# Altium project EnergyController.PrjPcb
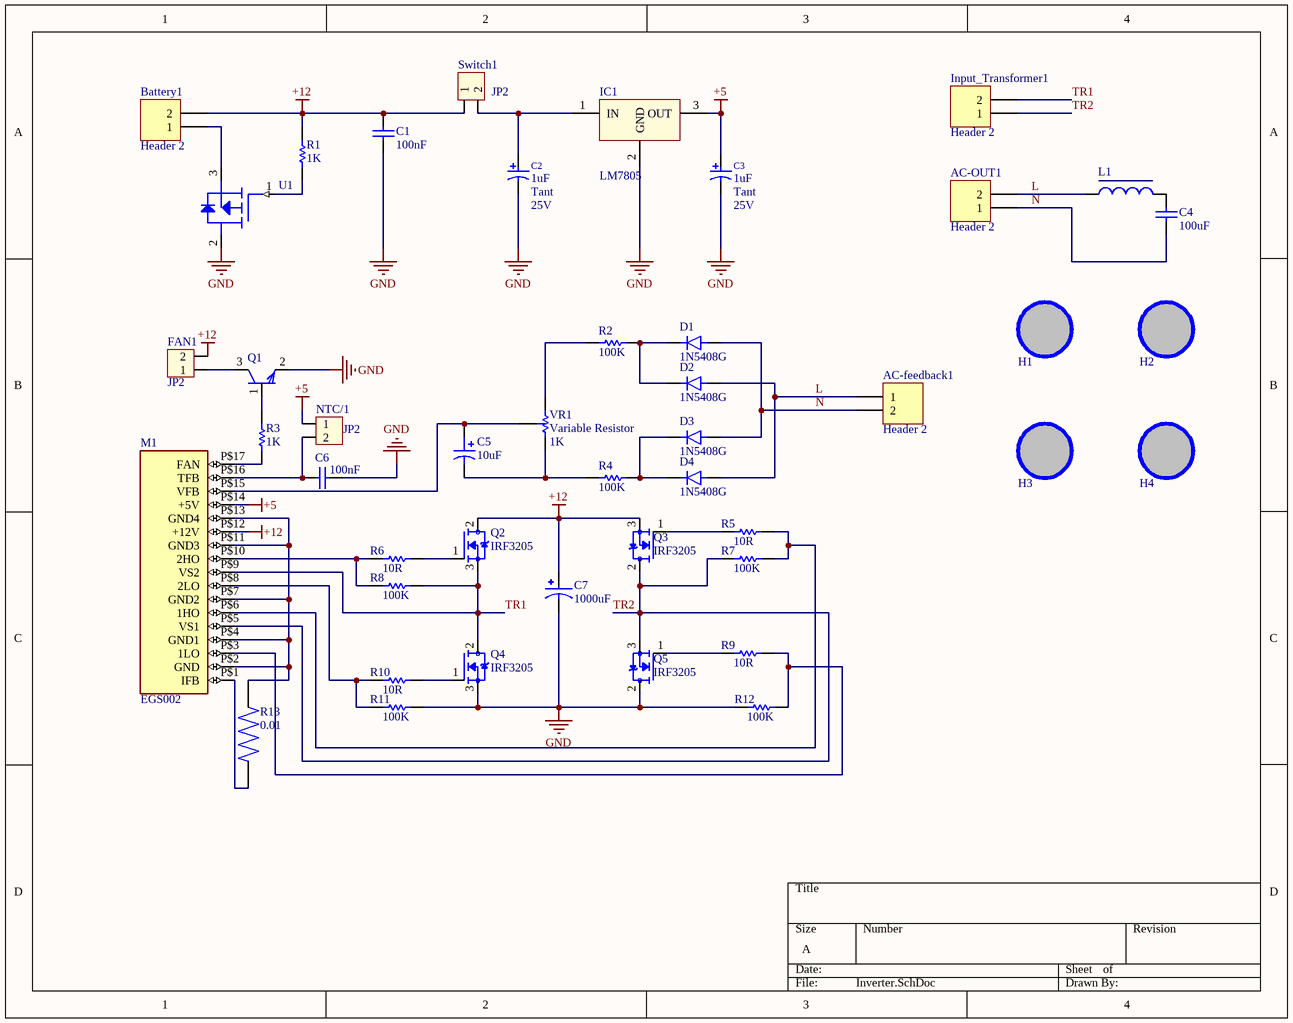
[diagram p0: Inverter.SchDoc]
1 sheet, 45 parts. Net scope: global (net labels, ports and power ports of the same name join across sheets).
Board file: PCB2.PcbDoc

## Sheet Inverter.SchDoc
size A; SheetNumber: 1; SheetTotal: 1

### Parts
AC-feedback1  Header 2  [PTBlock 2]
AC-OUT1  Header 2  [PTBlock 2]
Battery1  Header 2  [PTBlock 2]
C1  value 100nF  [Cap Non-Pol 3mm]  (hidden comment: Cap Non-pol)
C2  Capacitor Type: Tant  Volt: 25V  [RADIAL E]  (hidden comment: 1uF)
C3  Capacitor Type: Tant  Volt: 25V  [RADIAL E]  (hidden comment: 1uF)
C4  value 100uF  [Cap Non-Pol 5mm]  (hidden comment: Cap Non-pol)
C5  value 10uF  [RADIAL E]  (hidden comment: Cap Pol)
C6  value 100nF  [Cap Non-Pol 3mm]  (hidden comment: Cap Non-pol)
C7  1000uF  [CAPPRD750W80D1600H2500]
D1  1N5408G  [DIOAD1990W125L900D530]
D2  1N5408G  [DIOAD1990W125L900D530]
D3  1N5408G  [DIOAD1990W125L900D530]
D4  1N5408G  [DIOAD1990W125L900D530]
FAN1  JP2  [CON2]
H1  Hole  [LO KHOAN 3MM]  (value not drawn)
H2  Hole  [LO KHOAN 3MM]  (value not drawn)
H3  Hole  [LO KHOAN 3MM]  (value not drawn)
H4  Hole  [LO KHOAN 3MM]  (value not drawn)
IC1  LM7805  [QTO-220H3]
Input_Transformer1  Header 2  [PTBlock 2]
L1  (no value)  [Cuon day ferrite]
M1  EGS002  [EGS002]
NTC/1  JP2  [CON2]
Q1  C1815  [TO92-ECB-W]  (value not drawn)
Q2  IRF3205  [TO254P1067X483X3124-3P]
Q3  IRF3205  [TO254P1067X483X3124-3P]
Q4  IRF3205  [TO254P1067X483X3124-3P]
Q5  IRF3205  [TO254P1067X483X3124-3P]
R1  value 1K  [Res 10mm (1/2W)]  (hidden comment: RESISTOR)
R2  value 100K  [Res 10mm (1/2W)]  (hidden comment: RESISTOR)
R3  value 1K  [R-0805]  (hidden comment: RESISTOR)
R4  value 100K  [Res 10mm (1/2W)]  (hidden comment: RESISTOR)
R5  value 10R  [Res 10mm (1/2W)]  (hidden comment: RESISTOR)
R6  value 10R  [Res 10mm (1/2W)]  (hidden comment: RESISTOR)
R7  value 100K  [Res 10mm (1/2W)]  (hidden comment: RESISTOR)
R8  value 100K  [Res 10mm (1/2W)]  (hidden comment: RESISTOR)
R9  value 10R  [Res 10mm (1/2W)]  (hidden comment: RESISTOR)
R10  value 10R  [Res 10mm (1/2W)]  (hidden comment: RESISTOR)
R11  value 100K  [Res 10mm (1/2W)]  (hidden comment: RESISTOR)
R12  value 100K  [Res 10mm (1/2W)]  (hidden comment: RESISTOR)
R13  0.01  [RESC6432X75N]
Switch1  JP2  [CON2]
U1  IRF9540  [TO-263]  (value not drawn)
VR1  Variable Resistor  value 1K  [VRes-S]

### Nets
+5: C3.1 IC1.3(OUT) M1.P$14(+5V) NTC/1.1
+12: Battery1.2 C1.2 C7.P FAN1.2 M1.P$12(+12V) Q2.2(D) Q3.3(S) R1.2 Switch1.1
GND: C1.1 C2.2 C3.2 C6.1 C7.N IC1.2(GND) Q1.2(E) Q4.3(S) Q5.2(D) R11.1 R12.2 U1.2(D)
L: AC-feedback1.1 AC-OUT1.2 D2.A D4.A L1.1
N: AC-feedback1.2 AC-OUT1.1 C4.1 D1.A D3.A
TR1: Input_Transformer1.2 M1.P$9(VS2) Q2.3(S) Q4.2(D) R8.1
TR2: Input_Transformer1.1 M1.P$5(VS1) Q3.2(D) Q5.3(S) R7.2
NetBattery1_1: Battery1.1 U1.3(S)
NetC2_1: C2.1 IC1.1(IN) Switch1.2
NetC4_2: C4.2 L1.2
NetC5_1: C5.1 M1.P$15(VFB) VR1.2
NetC5_2: C5.2 R4.2 VR1.3
NetC6_2: C6.2 M1.P$16(TFB) NTC/1.2
NetD1_C: D1.C(K) D2.C(K) R2.1
NetD3_C: D3.C(K) D4.C(K) R4.1
NetFAN1_1: FAN1.1 Q1.3(C)
NetM1_P$1: M1.P$1(IFB) R13.1
NetM1_P$2: M1.P$2(GND) M1.P$4(GND1) M1.P$7(GND2) M1.P$11(GND3) M1.P$13(GND4) R13.2
NetM1_P$3: M1.P$3(1LO) R9.1 R12.1
NetM1_P$6: M1.P$6(1HO) R5.1 R7.1
NetM1_P$8: M1.P$8(2LO) R10.2 R11.2
NetM1_P$10: M1.P$10(2HO) R6.2 R8.2
NetM1_P$17: M1.P$17(FAN) R3.1
NetQ1_1: Q1.1(B) R3.2
NetQ2_1: Q2.1(G) R6.1
NetQ3_1: Q3.1(G) R5.2
NetQ4_1: Q4.1(G) R10.1
NetQ5_1: Q5.1(G) R9.2
NetR1_1: R1.1 U1.1(G)
NetR2_2: R2.2 VR1.1

Not connected (* = marked no-connect by the designer): H1 1; H2 1; H3 1; H4 1

### Library data of the parts
AC-feedback1 AC-OUT1 Battery1 Input_Transformer1 = Header 2: Header, 2-Pin; LatestRevisionDate: 17-Jul-2002; LatestRevisionNote: Re-released for DXP Platform.; Publisher: Altium Limited
C1 C4 C6 = Cap Non-pol: Non-polarized Capacitor; Published: 8-Jun-2000; LatestRevisionDate: 17-Jul-2002; LatestRevisionNote: Re-released for DXP Platform.; PackageReference: RAD-0.3; Publisher: Altium Limited
C2 C3 = Cap_Pol: Polarized Capacitor; Manufacturer: FARNELL; AEMS Code: 2100110; Vendor: Digikey; Published: 13-April-2009; Publisher: Hoang Nguyen; ComponentLink1Description: Digikey Part Link; ComponentLink2Description: Open Datasheet; ComponentLink2URL: H:\LIBRARY\LIBRARY.Datasheet\; Value: 1uF
C5 = Cap Pol: Polarized Capacitor; Published: 8-Jun-2000; LatestRevisionDate: 17-Jul-2002; LatestRevisionNote: Re-released for DXP Platform.; PackageReference: POLAR0.8; Publisher: Altium Limited
C7 = EEUTA1V102: CAP ALUM 1000UF 20% 35V RADIAL; MF: Panasonic Electronic Components; MP: EEU-TA1V102; Package: RADIAL-2 Panasonic; Check_prices: https://www.snapeda.com/parts/EEU-TA1V102/Panasonic/view-part/6222203/?ref=eda; Purchase-URL: https://pricing.snapeda.com/search/part/EEU-TA1V102/?ref=eda; SnapEDA_Link: https://www.snapeda.com/parts/EEU-TA1V102/Panasonic/view-part/6222203/?ref=snap; Price: None; Availability: In Stock; Value: *
D1-D4 = 1N5408G: DIODE GEN PURP 1KV 3A DO201AD | ON Semiconductor 1N5408G; SnapEDA_Link: https://www.snapeda.com/parts/1N5408G/Onsemi/view-part/?ref=snap; Package: AXIAL LEAD-2 ON Semiconductor; Value: *; MF: ON; MP: 1N5408G; Check_prices: https://www.snapeda.com/parts/1N5408G/Onsemi/view-part/?ref=eda
FAN1 NTC/1 Switch1 = Con2: Connector 2; Value: Connector 2
H1-H4 = Hole: Hole 3mm
IC1 = LM78xx_1: On ap +, from + 5 to + 24VDC; Value: LM7805
L1 = Inductor Ferrite: Cuon Cam L; Code_IEC: 1005; Vendor: Digikey; Published: 8-Jun-2000; LatestRevisionDate: 17-Jul-2002; LatestRevisionNote: Re-released for DXP Platform.; PackageReference: 0402-A; Publisher: Altium Limited; Code_JEITA: 0402; ComponentLink1Description: Digikey Part Link; ComponentLink2Description: Open Datasheet; ComponentLink2URL: H:\LIBRARY\LIBRARY.Datasheet\
M1 = EGS002: EGS002 is a driver board specific for single phase sinusoid inverter. It uses ASIC EG8010 as control chip and IR2110S as driver chip.; MF: EGmicro; Package: Package; Price: None; Value: *; SnapEDA_Link: https://www.snapeda.com/parts/EGS002/EGmicro/view-part/?ref=snap; MP: EGS002; Availability: Not in stock; Check_prices: https://www.snapeda.com/parts/EGS002/EGmicro/view-part/?ref=eda
Q1 = C1815: Q2SC1815; PSpiceTemplate: Q^@REFDES %c %b %e @MODEL; Vendor: Digikey; COMPONENT: 2SC1815; Published: 13-April-2009; Publisher: Hoang Nguyen; ComponentLink1Description: Digikey Part Link; ComponentLink2Description: Open Datasheet; ComponentLink2URL: H:\LIBRARY\LIBRARY.Datasheet\; Price: 500VND
Q2-Q5 = IRF3205PBF: MOSFET, Power,N-Ch,VDSS 55V,RDS(ON) 8 Milliohms,ID 110A,TO-220AB,PD 200W,gFS 44S | Infineon IRF3205PBF; MF: Infineon Technologies; SnapEDA_Link: https://www.snapeda.com/parts/IRF3205PBF/Infineon/view-part/?ref=snap; Package: TO-220-3 Infineon; Value: *; MP: IRF3205PBF; Check_prices: https://www.snapeda.com/parts/IRF3205PBF/Infineon/view-part/?ref=eda
R13 = CRS2512-FW-1R00ELF: CRS Series Anti-surge Resistor 2512 Case 1Ohms 2W +/-200ppm/degC | Bourns CRS2512-FW-1R00ELF; SnapEDA_Link: https://www.snapeda.com/parts/CRS2512-FW-1R00ELF/Bourns/view-part/?ref=snap; Package: 6432 Bourns; Value: *; MF: Bourns; MP: CRS2512-FW-1R00ELF; Check_prices: https://www.snapeda.com/parts/CRS2512-FW-1R00ELF/Bourns/view-part/?ref=eda
U1 = IRF9540: IRF9540 - P-CHANNEL POWER MOSFETS; Vendor: Digikey; Publisher: Hoang Nguyen; Price: 7.000 VND; ComponentLink2Description: Open Datasheet; ComponentLink2URL: H:\LIBRARY\LIBRARY.Datasheet\IRF9540.pdf; Published: 13-April-2009; ComponentLink1Description: Digikey Part Link
R1-R12 = RESISTOR: Published: 8-Jun-2000; LatestRevisionDate: 17-Jul-2002; LatestRevisionNote: Re-released for DXP Platform.; PackageReference: AXIAL-0.3; Publisher: Altium Limited
VR1 = Variable Resistor: Published: 8-Jun-2000; LatestRevisionDate: 17-Jul-2002; LatestRevisionNote: Re-released for DXP Platform.; PackageReference: AXIAL-0.3; Publisher: Altium Limited